# EAGLE schematic R3-URC18-4-003-001 (EAGLE 8.3.2)
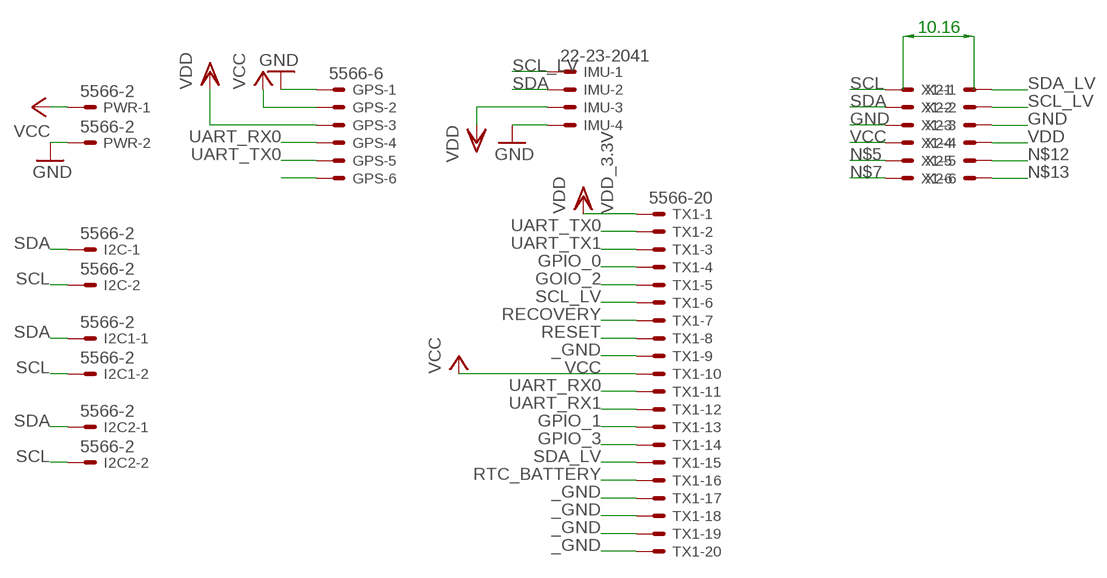
[diagram p0: schematic, sheet 1]

## Parts
GPS  5566-6  [5566-6]
I2C  5566-2  [5566-2]
I2C1  5566-2  [5566-2]
I2C2  5566-2  [5566-2]
IMU  22-23-2041  [22-23-2041]
PWR  5566-2  [5566-2]
TX1  5566-20  [5566-20]
X1  22-23-2061  [22-23-2061]
X2  22-23-2061  [22-23-2061]

## Nets
_GND: TX1.9 TX1.17 TX1.18 TX1.19 TX1.20
GND: GPS.1 IMU.4 PWR.2 X1.3 X2.3
GOIO_2: TX1.5
GPIO_0: TX1.4
GPIO_1: TX1.13
GPIO_3: TX1.14
N$5: X1.5
N$6: GPS.6
N$7: X1.6
N$12: X2.5
N$13: X2.6
RECOVERY: TX1.7
RESET: TX1.8
RTC_BATTERY: TX1.16
SCL: I2C1.2 I2C2.2 I2C.2 X1.1
SCL_LV: IMU.1 TX1.6 X2.2
SDA: I2C1.1 I2C2.1 I2C.1 IMU.2 X1.2
SDA_LV: TX1.15 X2.1
UART_RX0: GPS.4 TX1.11
UART_RX1: TX1.12
UART_TX0: GPS.5 TX1.2
UART_TX1: TX1.3
VCC: GPS.2 PWR.1 TX1.10 X1.4
VDD: GPS.3 IMU.3 X2.4
VDD_3.3V: TX1.1 ; supply symbol labelled VDD

## Library data of the parts
GPS = con-molex:5566-6: Mini FIT connector 6 pol Source: http://www.molex.com; MPN: 95566-61002; OC_FARNELL: unknown; OC_NEWARK: 22K8620
I2C I2C1 I2C2 PWR = con-molex:5566-2: Mini FIT connector 2 pol Source: http://www.molex.com; OC_FARNELL: 1822072; OC_NEWARK: unknown
IMU = con-molex:22-23-2041: .100" (2.54mm) Center Header - 4 Pin; MF: MOLEX; MPN: 22-23-2041; OC_FARNELL: 1462920; OC_NEWARK: 38C0355
TX1 = con-molex:5566-20: Mini FIT connector 20 pol ATX PC-Motherboard Power connector Source: http://www.molex.com; OC_FARNELL: unknown; OC_NEWARK: unknown
X1 X2 = con-molex:22-23-2061: .100" (2.54mm) Center Header - 6 Pin; MF: MOLEX; MPN: 22-23-2061; OC_FARNELL: 1462922; OC_NEWARK: 27C1933